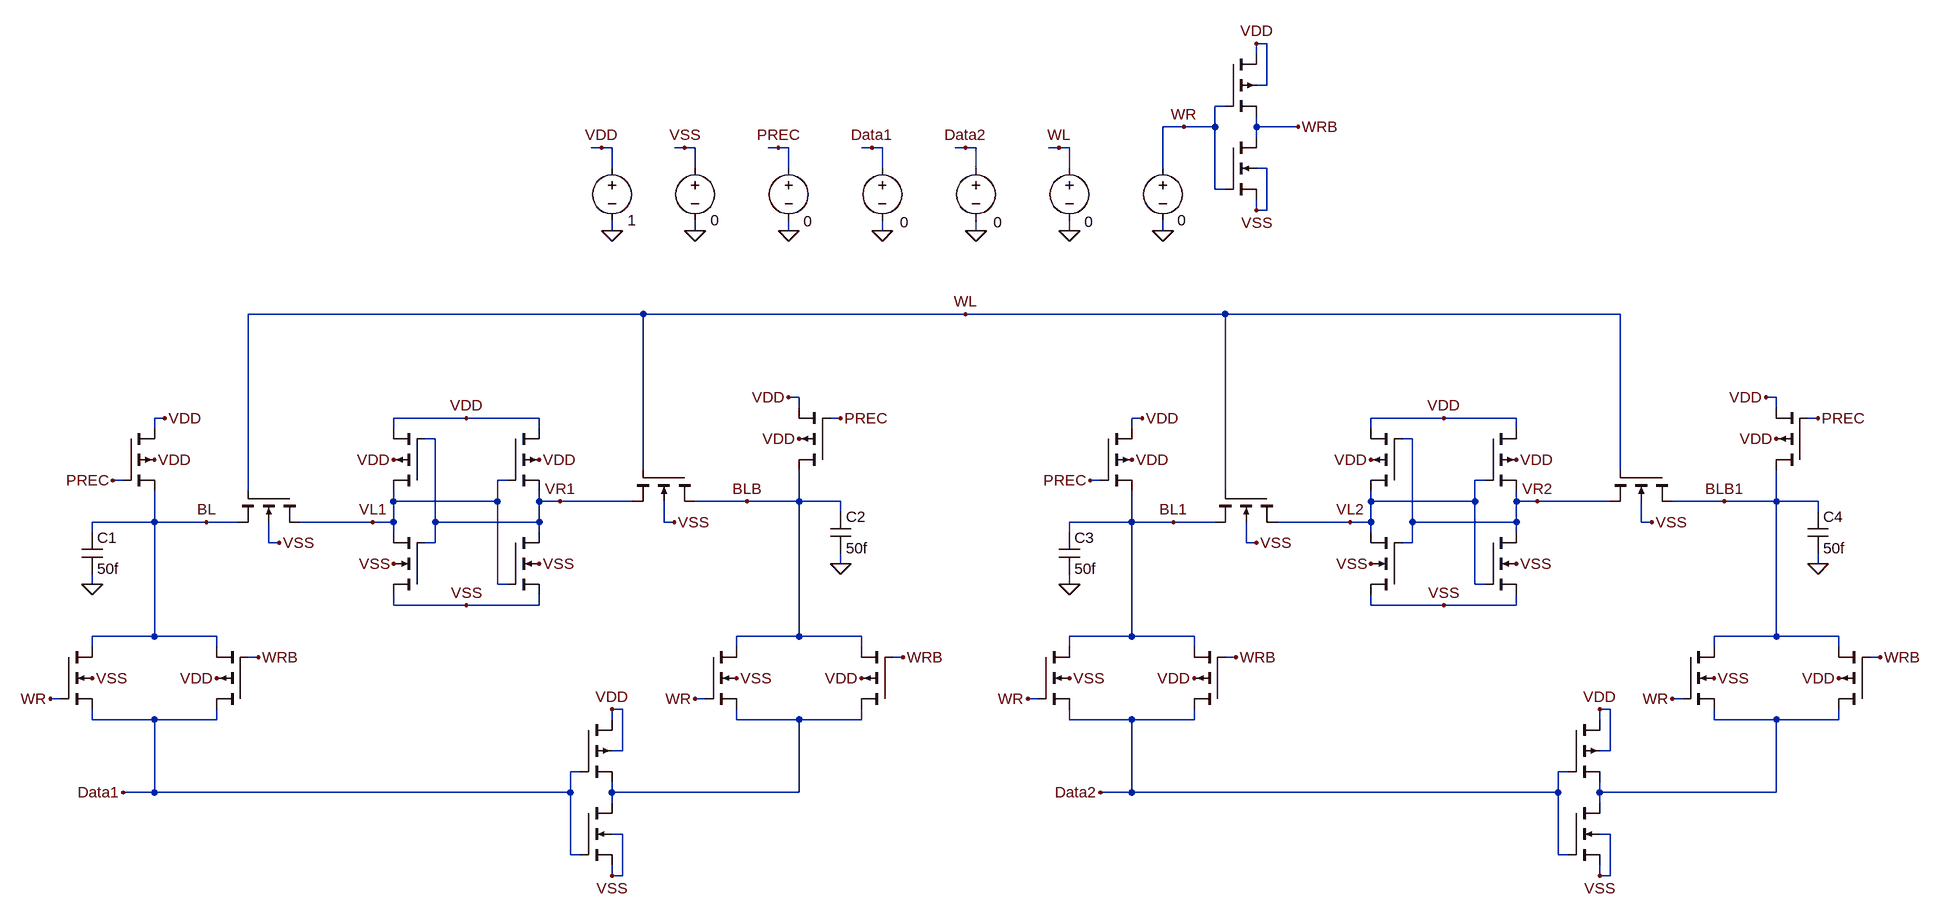
[diagram p0: schematic Stage 2 Part A.asc]
Stage 2 Part A.asc, the LTspice schematic file:
Version 4
SHEET 1 2304 1116
WIRE 944 -1168 928 -1168
WIRE 928 -1152 928 -1168
WIRE 944 -1104 944 -1168
WIRE 944 -1104 928 -1104
WIRE 880 -1072 864 -1072
WIRE 816 -1040 784 -1040
WIRE 864 -1040 864 -1072
WIRE 864 -1040 816 -1040
WIRE 928 -1040 928 -1056
WIRE 992 -1040 928 -1040
WIRE 928 -1024 928 -1040
WIRE -80 -1008 -96 -1008
WIRE -64 -1008 -80 -1008
WIRE 48 -1008 32 -1008
WIRE 64 -1008 48 -1008
WIRE 192 -1008 176 -1008
WIRE 208 -1008 192 -1008
WIRE 336 -1008 320 -1008
WIRE 352 -1008 336 -1008
WIRE 480 -1008 464 -1008
WIRE 496 -1008 480 -1008
WIRE 624 -1008 608 -1008
WIRE 640 -1008 624 -1008
WIRE -64 -976 -64 -1008
WIRE 64 -976 64 -1008
WIRE 208 -976 208 -1008
WIRE 352 -976 352 -1008
WIRE 496 -976 496 -1008
WIRE 640 -976 640 -1008
WIRE 784 -976 784 -1040
WIRE 944 -976 928 -976
WIRE 864 -944 864 -1040
WIRE 880 -944 864 -944
WIRE 928 -912 928 -928
WIRE 944 -912 944 -976
WIRE 944 -912 928 -912
WIRE -64 -880 -64 -896
WIRE 64 -880 64 -896
WIRE 208 -880 208 -896
WIRE 352 -880 352 -896
WIRE 496 -880 496 -896
WIRE 640 -880 640 -896
WIRE 784 -880 784 -896
WIRE -16 -752 -624 -752
WIRE 480 -752 -16 -752
WIRE 880 -752 480 -752
WIRE 1488 -752 880 -752
WIRE 224 -624 208 -624
WIRE 1728 -624 1712 -624
WIRE 224 -608 224 -624
WIRE 1728 -608 1728 -624
WIRE -752 -592 -768 -592
WIRE -288 -592 -400 -592
WIRE -176 -592 -288 -592
WIRE 288 -592 272 -592
WIRE 752 -592 736 -592
WIRE 1216 -592 1104 -592
WIRE 1328 -592 1216 -592
WIRE 1792 -592 1776 -592
WIRE -768 -576 -768 -592
WIRE -400 -576 -400 -592
WIRE -176 -576 -176 -592
WIRE 736 -576 736 -592
WIRE 1104 -576 1104 -592
WIRE 1328 -576 1328 -592
WIRE -336 -560 -352 -560
WIRE 1168 -560 1152 -560
WIRE -16 -512 -16 -752
WIRE 1488 -512 1488 -752
WIRE -816 -496 -832 -496
WIRE -224 -496 -240 -496
WIRE 688 -496 672 -496
WIRE 1280 -496 1264 -496
WIRE -624 -480 -624 -752
WIRE 880 -480 880 -752
WIRE -400 -464 -400 -480
WIRE -240 -464 -240 -496
WIRE -240 -464 -400 -464
WIRE -176 -464 -176 -480
WIRE -144 -464 -176 -464
WIRE -32 -464 -144 -464
WIRE 144 -464 64 -464
WIRE 224 -464 224 -512
WIRE 224 -464 144 -464
WIRE 288 -464 224 -464
WIRE 1104 -464 1104 -480
WIRE 1264 -464 1264 -496
WIRE 1264 -464 1104 -464
WIRE 1328 -464 1328 -480
WIRE 1360 -464 1328 -464
WIRE 1472 -464 1360 -464
WIRE 1648 -464 1568 -464
WIRE 1728 -464 1728 -512
WIRE 1728 -464 1648 -464
WIRE 1792 -464 1728 -464
WIRE 288 -448 288 -464
WIRE 1792 -448 1792 -464
WIRE -768 -432 -768 -480
WIRE -768 -432 -864 -432
WIRE -688 -432 -768 -432
WIRE -640 -432 -688 -432
WIRE -432 -432 -544 -432
WIRE -400 -432 -400 -464
WIRE -400 -432 -432 -432
WIRE -336 -432 -336 -560
WIRE -176 -432 -176 -464
WIRE -176 -432 -336 -432
WIRE 16 -432 16 -464
WIRE 32 -432 16 -432
WIRE 736 -432 736 -480
WIRE 736 -432 640 -432
WIRE 800 -432 736 -432
WIRE 864 -432 800 -432
WIRE 1072 -432 960 -432
WIRE 1104 -432 1104 -464
WIRE 1104 -432 1072 -432
WIRE 1168 -432 1168 -560
WIRE 1328 -432 1328 -464
WIRE 1328 -432 1168 -432
WIRE 1520 -432 1520 -464
WIRE 1536 -432 1520 -432
WIRE -864 -416 -864 -432
WIRE -400 -416 -400 -432
WIRE -176 -416 -176 -432
WIRE 640 -416 640 -432
WIRE 1104 -416 1104 -432
WIRE 1328 -416 1328 -432
WIRE -592 -400 -592 -432
WIRE -576 -400 -592 -400
WIRE -336 -400 -336 -432
WIRE -336 -400 -352 -400
WIRE 912 -400 912 -432
WIRE 928 -400 912 -400
WIRE 1168 -400 1168 -432
WIRE 1168 -400 1152 -400
WIRE 288 -368 288 -384
WIRE 1792 -368 1792 -384
WIRE -864 -336 -864 -352
WIRE -240 -336 -240 -464
WIRE -224 -336 -240 -336
WIRE 640 -336 640 -352
WIRE 1264 -336 1264 -464
WIRE 1280 -336 1264 -336
WIRE -400 -304 -400 -320
WIRE -288 -304 -400 -304
WIRE -176 -304 -176 -320
WIRE -176 -304 -288 -304
WIRE 1104 -304 1104 -320
WIRE 1216 -304 1104 -304
WIRE 1328 -304 1328 -320
WIRE 1328 -304 1216 -304
WIRE -768 -256 -768 -432
WIRE -768 -256 -864 -256
WIRE -672 -256 -768 -256
WIRE 224 -256 224 -464
WIRE 224 -256 128 -256
WIRE 320 -256 224 -256
WIRE 736 -256 736 -432
WIRE 736 -256 640 -256
WIRE 832 -256 736 -256
WIRE 1728 -256 1728 -464
WIRE 1728 -256 1632 -256
WIRE 1824 -256 1728 -256
WIRE -864 -240 -864 -256
WIRE -672 -240 -672 -256
WIRE 128 -240 128 -256
WIRE 320 -240 320 -256
WIRE 640 -240 640 -256
WIRE 832 -240 832 -256
WIRE 1632 -240 1632 -256
WIRE 1824 -240 1824 -256
WIRE -608 -224 -624 -224
WIRE 384 -224 368 -224
WIRE 896 -224 880 -224
WIRE 1888 -224 1872 -224
WIRE -912 -160 -928 -160
WIRE 80 -160 64 -160
WIRE 592 -160 576 -160
WIRE 1584 -160 1568 -160
WIRE -48 -144 -64 -144
WIRE 1472 -144 1456 -144
WIRE -864 -128 -864 -144
WIRE -768 -128 -864 -128
WIRE -672 -128 -672 -144
WIRE -672 -128 -768 -128
WIRE -64 -128 -64 -144
WIRE 128 -128 128 -144
WIRE 224 -128 128 -128
WIRE 320 -128 320 -144
WIRE 320 -128 224 -128
WIRE 640 -128 640 -144
WIRE 736 -128 640 -128
WIRE 832 -128 832 -144
WIRE 832 -128 736 -128
WIRE 1456 -128 1456 -144
WIRE 1632 -128 1632 -144
WIRE 1728 -128 1632 -128
WIRE 1824 -128 1824 -144
WIRE 1824 -128 1728 -128
WIRE -48 -80 -48 -144
WIRE -48 -80 -64 -80
WIRE 1472 -80 1472 -144
WIRE 1472 -80 1456 -80
WIRE -112 -48 -128 -48
WIRE 1408 -48 1392 -48
WIRE -768 -16 -768 -128
WIRE -768 -16 -816 -16
WIRE -128 -16 -128 -48
WIRE -128 -16 -768 -16
WIRE -64 -16 -64 -32
WIRE 224 -16 224 -128
WIRE 224 -16 -64 -16
WIRE 736 -16 736 -128
WIRE 736 -16 688 -16
WIRE 1392 -16 1392 -48
WIRE 1392 -16 736 -16
WIRE 1456 -16 1456 -32
WIRE 1728 -16 1728 -128
WIRE 1728 -16 1456 -16
WIRE -64 0 -64 -16
WIRE 1456 0 1456 -16
WIRE -48 48 -64 48
WIRE 1472 48 1456 48
WIRE -128 80 -128 -16
WIRE -112 80 -128 80
WIRE 1392 80 1392 -16
WIRE 1408 80 1392 80
WIRE -64 112 -64 96
WIRE -48 112 -48 48
WIRE -48 112 -64 112
WIRE 1456 112 1456 96
WIRE 1472 112 1472 48
WIRE 1472 112 1456 112
FLAG -64 -880 0
FLAG 64 -880 0
FLAG -80 -1008 VDD
FLAG 48 -1008 VSS
FLAG -400 -528 VDD
FLAG -176 -528 VDD
FLAG -176 -368 VSS
FLAG -400 -368 VSS
FLAG -288 -592 VDD
FLAG -288 -304 VSS
FLAG -672 -192 VDD
FLAG -864 -192 VSS
FLAG 320 -192 VDD
FLAG 128 -192 VSS
FLAG -64 -144 VDD
FLAG -64 112 VSS
FLAG -752 -592 VDD
FLAG 208 -624 VDD
FLAG -768 -528 VDD
FLAG 224 -560 VDD
FLAG -576 -400 VSS
FLAG 32 -432 VSS
FLAG -864 -336 0
FLAG 288 -368 0
FLAG 208 -880 0
FLAG 640 -880 0
FLAG 784 -880 0
FLAG 928 -1168 VDD
FLAG 928 -912 VSS
FLAG 992 -1040 WRB
FLAG 816 -1040 WR
FLAG 624 -1008 WL
FLAG 192 -1008 PREC
FLAG 496 -880 0
FLAG 480 -1008 Data2
FLAG -832 -496 PREC
FLAG 288 -592 PREC
FLAG -928 -160 WR
FLAG 64 -160 WR
FLAG -608 -224 WRB
FLAG 384 -224 WRB
FLAG -816 -16 Data1
FLAG -432 -432 VL1
FLAG -144 -464 VR1
FLAG 1104 -528 VDD
FLAG 1328 -528 VDD
FLAG 1328 -368 VSS
FLAG 1104 -368 VSS
FLAG 1216 -592 VDD
FLAG 1216 -304 VSS
FLAG 832 -192 VDD
FLAG 640 -192 VSS
FLAG 1824 -192 VDD
FLAG 1632 -192 VSS
FLAG 1456 -144 VDD
FLAG 1456 112 VSS
FLAG 752 -592 VDD
FLAG 1712 -624 VDD
FLAG 736 -528 VDD
FLAG 1728 -560 VDD
FLAG 928 -400 VSS
FLAG 1536 -432 VSS
FLAG 640 -336 0
FLAG 1792 -368 0
FLAG 672 -496 PREC
FLAG 1792 -592 PREC
FLAG 576 -160 WR
FLAG 1568 -160 WR
FLAG 896 -224 WRB
FLAG 1888 -224 WRB
FLAG 688 -16 Data2
FLAG 1072 -432 VL2
FLAG 1360 -464 VR2
FLAG 480 -752 WL
FLAG 352 -880 0
FLAG 336 -1008 Data1
FLAG 800 -432 BL1
FLAG 1648 -464 BLB1
FLAG -688 -432 BL
FLAG 144 -464 BLB
SYMBOL pmos4 -352 -480 R180
WINDOW 0 56 32 Invisible 2
WINDOW 3 56 72 Invisible 2
SYMATTR InstName M1
SYMATTR Value2 l=0.03u w=699.3u
SYMBOL pmos4 -224 -576 R0
WINDOW 0 56 32 Invisible 2
WINDOW 3 56 72 Invisible 2
SYMATTR InstName M2
SYMATTR Value2 l=0.03u w=699.3u
SYMBOL nmos4 -352 -320 R180
WINDOW 0 56 32 Invisible 2
WINDOW 3 56 72 Invisible 2
SYMATTR InstName M3
SYMATTR Value2 l=0.03u w=399.6u
SYMBOL nmos4 -224 -416 R0
WINDOW 0 56 32 Invisible 2
WINDOW 3 56 72 Invisible 2
SYMATTR InstName M4
SYMATTR Value2 l=0.03u w=399.6u
SYMBOL voltage -64 -992 R0
WINDOW 123 0 0 Left 2
WINDOW 39 0 0 Left 2
WINDOW 0 24 16 Invisible 2
SYMATTR InstName V1
SYMATTR Value 1
SYMBOL voltage 64 -992 R0
WINDOW 123 0 0 Left 2
WINDOW 39 0 0 Left 2
WINDOW 0 24 16 Invisible 2
SYMATTR InstName V2
SYMATTR Value 0
SYMBOL pmos4 -624 -144 R180
WINDOW 0 56 32 Invisible 2
WINDOW 3 56 72 Invisible 2
SYMATTR InstName M5
SYMATTR Value2 l=0.03u w=699.3u
SYMBOL nmos4 -912 -240 R0
WINDOW 0 56 32 Invisible 2
WINDOW 3 56 72 Invisible 2
SYMATTR InstName M6
SYMATTR Value2 l=0.03u w=399.6u
SYMBOL pmos4 368 -144 R180
WINDOW 0 56 32 Invisible 2
WINDOW 3 56 72 Invisible 2
SYMATTR InstName M7
SYMATTR Value2 l=0.03u w=699.3u
SYMBOL nmos4 80 -240 R0
WINDOW 0 56 32 Invisible 2
WINDOW 3 56 72 Invisible 2
SYMATTR InstName M8
SYMATTR Value2 l=0.03u w=399.6u
SYMBOL pmos4 -112 -128 R0
WINDOW 0 56 32 Invisible 2
WINDOW 3 56 72 Invisible 2
SYMATTR InstName M9
SYMATTR Value2 l=0.03u w=699.3u
SYMBOL nmos4 -112 0 R0
WINDOW 0 56 32 Invisible 2
WINDOW 3 56 72 Invisible 2
SYMATTR InstName M10
SYMATTR Value2 l=0.03u w=399.6u
SYMBOL pmos4 -816 -576 R0
WINDOW 0 56 32 Invisible 2
WINDOW 3 56 72 Invisible 2
SYMATTR InstName M11
SYMATTR Value2 l=0.03u w=699.3u
SYMBOL pmos4 272 -512 R180
WINDOW 0 56 32 Invisible 2
WINDOW 3 56 72 Invisible 2
SYMATTR InstName M12
SYMATTR Value2 l=0.03u w=699.3u
SYMBOL nmos4 -544 -480 R90
WINDOW 0 56 32 Invisible 2
WINDOW 3 56 72 Invisible 2
SYMATTR InstName M13
SYMATTR Value2 l=0.03u w=799.2u
SYMBOL nmos4 64 -512 R90
WINDOW 0 56 32 Invisible 2
WINDOW 3 56 72 Invisible 2
SYMATTR InstName M14
SYMATTR Value2 l=0.03u w=799.2u
SYMBOL cap -880 -416 R0
SYMATTR InstName C1
SYMATTR Value 50f
SYMBOL cap 272 -448 R0
SYMATTR InstName C2
SYMATTR Value 50f
SYMBOL voltage 208 -992 R0
WINDOW 123 0 0 Left 2
WINDOW 39 0 0 Left 2
WINDOW 0 24 16 Invisible 2
WINDOW 3 23 97 Left 2
SYMATTR InstName V3
SYMATTR Value 0
SYMBOL voltage 640 -992 R0
WINDOW 123 0 0 Left 2
WINDOW 39 0 0 Left 2
WINDOW 0 24 16 Invisible 2
WINDOW 3 23 98 Left 2
SYMATTR InstName V4
SYMATTR Value 0
SYMBOL voltage 784 -992 R0
WINDOW 123 0 0 Left 2
WINDOW 39 0 0 Left 2
WINDOW 0 24 16 Invisible 2
WINDOW 3 22 96 Left 2
SYMATTR InstName V5
SYMATTR Value 0
SYMBOL pmos4 880 -1152 R0
WINDOW 0 56 32 Invisible 2
WINDOW 3 56 72 Invisible 2
SYMATTR InstName M15
SYMATTR Value2 l=0.03u w=0.7u
SYMBOL nmos4 880 -1024 R0
WINDOW 0 56 32 Invisible 2
WINDOW 3 56 72 Invisible 2
SYMATTR InstName M16
SYMATTR Value2 l=0.03u w=0.4u
SYMBOL voltage 496 -992 R0
WINDOW 123 0 0 Left 2
WINDOW 39 0 0 Left 2
WINDOW 0 24 16 Invisible 2
WINDOW 3 27 99 Left 2
SYMATTR InstName V6
SYMATTR Value 0
SYMBOL pmos4 1152 -480 R180
WINDOW 0 56 32 Invisible 2
WINDOW 3 56 72 Invisible 2
SYMATTR InstName M17
SYMATTR Value2 l=0.03u w=0.7u
SYMBOL pmos4 1280 -576 R0
WINDOW 0 56 32 Invisible 2
WINDOW 3 56 72 Invisible 2
SYMATTR InstName M18
SYMATTR Value2 l=0.03u w=0.7u
SYMBOL nmos4 1152 -320 R180
WINDOW 0 56 32 Invisible 2
WINDOW 3 56 72 Invisible 2
SYMATTR InstName M19
SYMATTR Value2 l=0.03u w=0.4u
SYMBOL nmos4 1280 -416 R0
WINDOW 0 56 32 Invisible 2
WINDOW 3 56 72 Invisible 2
SYMATTR InstName M20
SYMATTR Value2 l=0.03u w=0.4u
SYMBOL pmos4 880 -144 R180
WINDOW 0 56 32 Invisible 2
WINDOW 3 56 72 Invisible 2
SYMATTR InstName M21
SYMATTR Value2 l=0.03u w=0.7u
SYMBOL nmos4 592 -240 R0
WINDOW 0 56 32 Invisible 2
WINDOW 3 56 72 Invisible 2
SYMATTR InstName M22
SYMATTR Value2 l=0.03u w=0.4u
SYMBOL pmos4 1872 -144 R180
WINDOW 0 56 32 Invisible 2
WINDOW 3 56 72 Invisible 2
SYMATTR InstName M23
SYMATTR Value2 l=0.03u w=0.7u
SYMBOL nmos4 1584 -240 R0
WINDOW 0 56 32 Invisible 2
WINDOW 3 56 72 Invisible 2
SYMATTR InstName M24
SYMATTR Value2 l=0.03u w=0.4u
SYMBOL pmos4 1408 -128 R0
WINDOW 0 56 32 Invisible 2
WINDOW 3 56 72 Invisible 2
SYMATTR InstName M25
SYMATTR Value2 l=0.03u w=0.7u
SYMBOL nmos4 1408 0 R0
WINDOW 0 56 32 Invisible 2
WINDOW 3 56 72 Invisible 2
SYMATTR InstName M26
SYMATTR Value2 l=0.03u w=0.4u
SYMBOL pmos4 688 -576 R0
WINDOW 0 56 32 Invisible 2
WINDOW 3 56 72 Invisible 2
SYMATTR InstName M27
SYMATTR Value2 l=0.03u w=0.7u
SYMBOL pmos4 1776 -512 R180
WINDOW 0 56 32 Invisible 2
WINDOW 3 56 72 Invisible 2
SYMATTR InstName M28
SYMATTR Value2 l=0.03u w=0.7u
SYMBOL nmos4 960 -480 R90
WINDOW 0 56 32 Invisible 2
WINDOW 3 56 72 Invisible 2
SYMATTR InstName M29
SYMATTR Value2 l=0.03u w=0.8u
SYMBOL nmos4 1568 -512 R90
WINDOW 0 56 32 Invisible 2
WINDOW 3 56 72 Invisible 2
SYMATTR InstName M30
SYMATTR Value2 l=0.03u w=0.8u
SYMBOL cap 624 -416 R0
SYMATTR InstName C3
SYMATTR Value 50f
SYMBOL cap 1776 -448 R0
SYMATTR InstName C4
SYMATTR Value 50f
SYMBOL voltage 352 -992 R0
WINDOW 123 0 0 Left 2
WINDOW 39 0 0 Left 2
WINDOW 0 24 16 Invisible 2
WINDOW 3 27 99 Left 2
SYMATTR InstName V7
SYMATTR Value 0

The netlist it stands for:
* Stage 2 Part A.asc
M1 VL1 VR1 VDD VDD PMOS l=0.03u w=699.3u
M2 VDD VL1 VR1 VDD PMOS l=0.03u w=699.3u
M3 VSS VR1 VL1 VSS NMOS l=0.03u w=399.6u
M4 VR1 VL1 VSS VSS NMOS l=0.03u w=399.6u
V1 VDD 0 1
V2 VSS 0 0
M5 Data1 WRB BL VDD PMOS l=0.03u w=699.3u
M6 BL WR Data1 VSS NMOS l=0.03u w=399.6u
M7 N001 WRB BLB VDD PMOS l=0.03u w=699.3u
M8 BLB WR N001 VSS NMOS l=0.03u w=399.6u
M9 VDD Data1 N001 VDD PMOS l=0.03u w=699.3u
M10 N001 Data1 VSS VSS NMOS l=0.03u w=399.6u
M11 VDD PREC BL VDD PMOS l=0.03u w=699.3u
M12 BLB PREC VDD VDD PMOS l=0.03u w=699.3u
M13 VL1 WL BL VSS NMOS l=0.03u w=799.2u
M14 BLB WL VR1 VSS NMOS l=0.03u w=799.2u
C1 BL 0 50f
C2 BLB 0 50f
V3 PREC 0 0
V4 WL 0 0
V5 WR 0 0
M15 VDD WR WRB VDD PMOS l=0.03u w=0.7u
M16 WRB WR VSS VSS NMOS l=0.03u w=0.4u
V6 Data2 0 0
M17 VL2 VR2 VDD VDD PMOS l=0.03u w=0.7u
M18 VDD VL2 VR2 VDD PMOS l=0.03u w=0.7u
M19 VSS VR2 VL2 VSS NMOS l=0.03u w=0.4u
M20 VR2 VL2 VSS VSS NMOS l=0.03u w=0.4u
M21 Data2 WRB BL1 VDD PMOS l=0.03u w=0.7u
M22 BL1 WR Data2 VSS NMOS l=0.03u w=0.4u
M23 N002 WRB BLB1 VDD PMOS l=0.03u w=0.7u
M24 BLB1 WR N002 VSS NMOS l=0.03u w=0.4u
M25 VDD Data2 N002 VDD PMOS l=0.03u w=0.7u
M26 N002 Data2 VSS VSS NMOS l=0.03u w=0.4u
M27 VDD PREC BL1 VDD PMOS l=0.03u w=0.7u
M28 BLB1 PREC VDD VDD PMOS l=0.03u w=0.7u
M29 VL2 WL BL1 VSS NMOS l=0.03u w=0.8u
M30 BLB1 WL VR2 VSS NMOS l=0.03u w=0.8u
C3 BL1 0 50f
C4 BLB1 0 50f
V7 Data1 0 0
.model NMOS NMOS
.model PMOS PMOS
.lib standard.mos
.backanno
.end